# EAGLE design a78-flashcart (EAGLE 7.7.0)
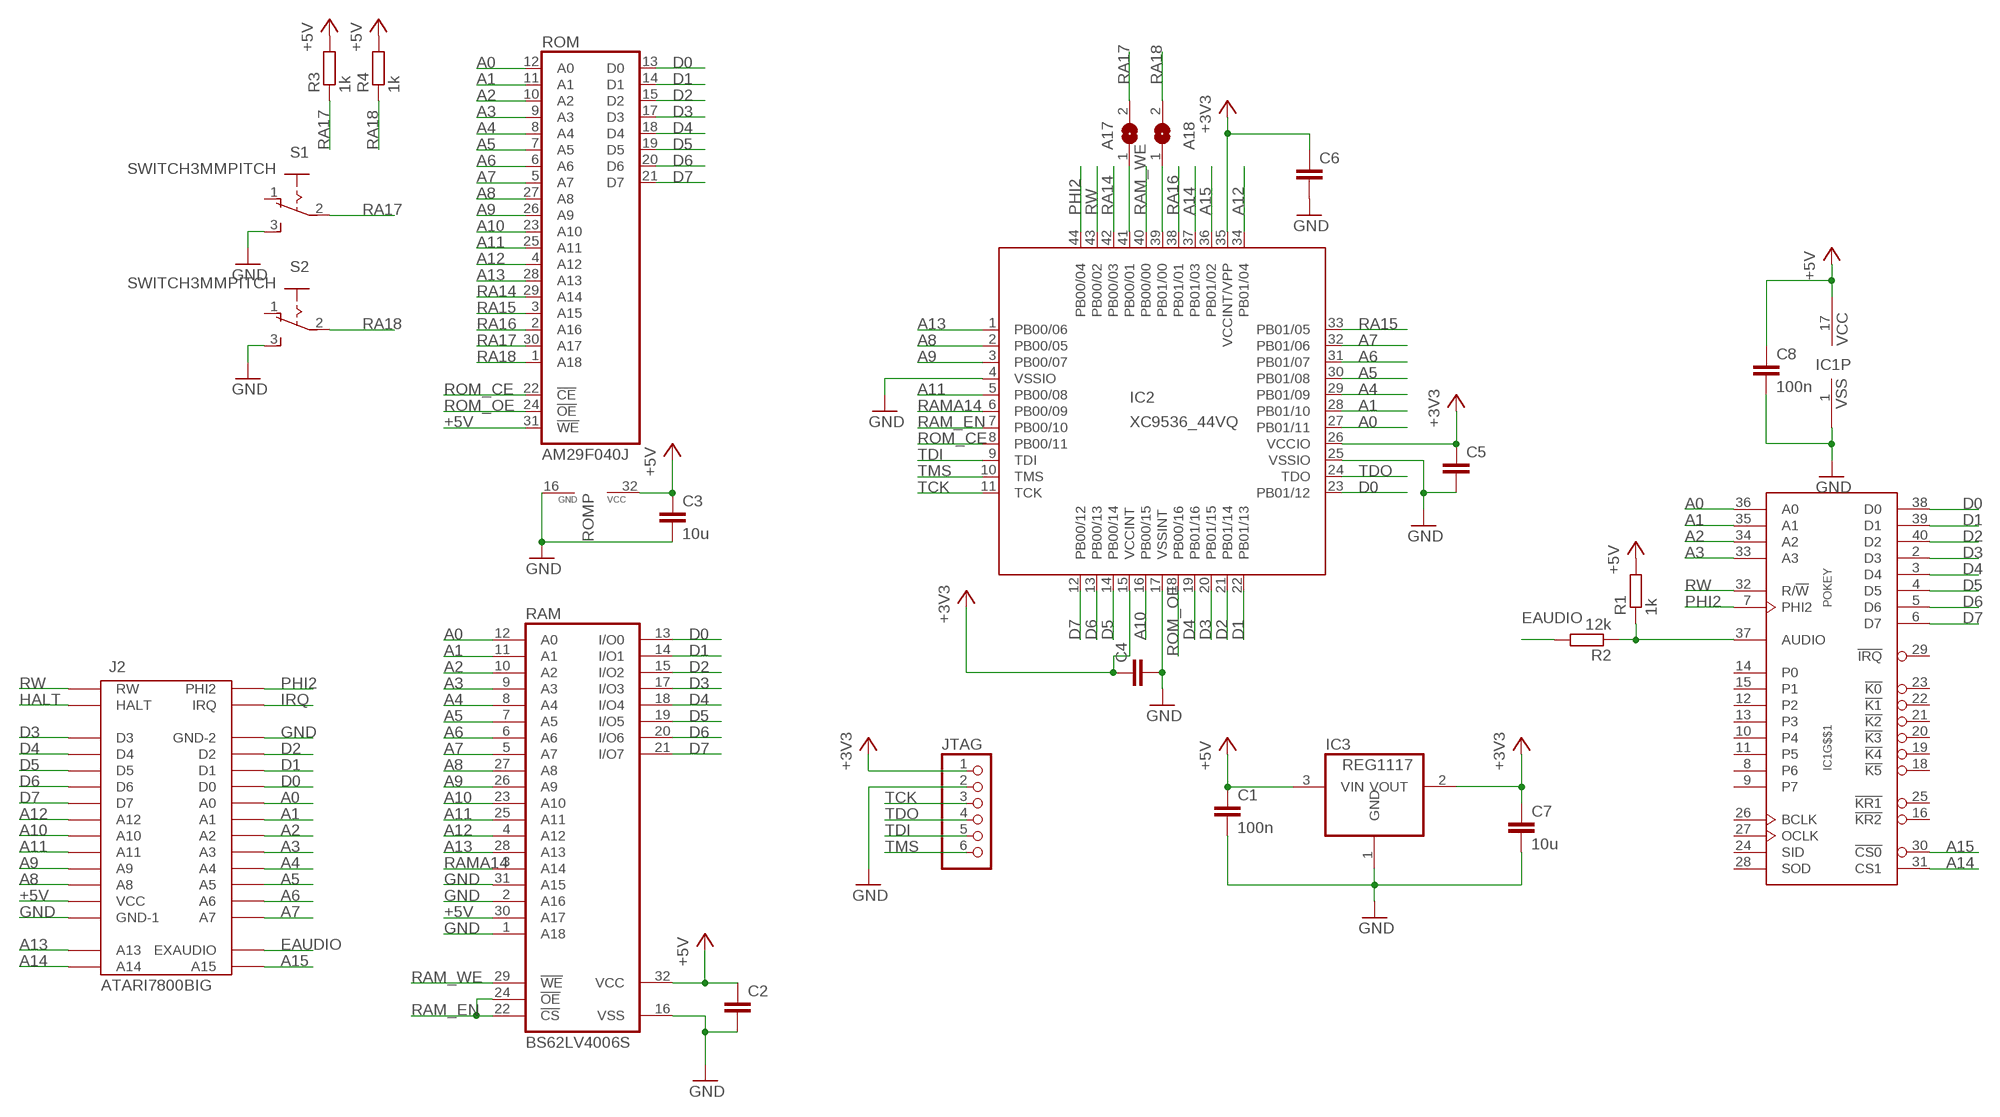
[diagram p0: schematic, sheet 1]

## Parts
A17  SJ  [SJ]
A18  SJ  [SJ]
C1  100n  C-EUC0805  [C0805]
C2  C-EUC0805  [C0805]
C3  10u  C-EUC0805  [C0805]
C4  C-EUC0805  [C0805]
C5  C-EUC0805  [C0805]
C6  C-EUC0805  [C0805]
C7  10u  C-EUC0805  [C0805]
C8  100n  C-EUC0805  [C0805]
IC1  POKEY  [DIL40]
IC2  XC9536_44VQ  [SQFP-S-10X10-44]
IC3  REG1117  [SOT223]
J2  ATARI7800BIG  [ATARI-7800-BIG]
JTAG  PINHD-1X6  [1X06]
R1  1k  R-EU_R0805  [R0805]
R2  12k  R-EU_R0805  [R0805]
R3  1k  R-EU_R0805  [R0805]
R4  1k  R-EU_R0805  [R0805]
RAM  BS62LV4006S  [SOP-32]
ROM  AM29F040J  [PLCC32R]
S1  SWITCH3MMPITCH  [SWITCH3MMPITCH]
S2  SWITCH3MMPITCH  [SWITCH3MMPITCH]

## Nets
+3V3: C4.1 C5.1 C6.1 C7.1 IC2.15(VCCINT) IC2.26(VCCIO) IC2.35(VCCINT/VPP) IC3.2(VOUT) JTAG.1
+5V: C1.1 C2.1 C3.1 C8.1 IC1.17(P:VCC) IC3.3(VIN) J2.13(VCC) R1.2 R3.2 R4.2 RAM.30(A17) RAM.32(VCC) ROM.31(!WE) ROM.32(VCC)
A0: IC1.36(G$$1:A0) IC2.27(PB01/11) J2.26(A0) RAM.12(A0) ROM.12(A0)
A1: IC1.35(G$$1:A1) IC2.28(PB01/10) J2.25(A1) RAM.11(A1) ROM.11(A1)
A2: IC1.34(G$$1:A2) J2.24(A2) RAM.10(A2) ROM.10(A2)
A3: IC1.33(G$$1:A3) J2.23(A3) RAM.9(A3) ROM.9(A3)
A4: IC2.29(PB01/09) J2.22(A4) RAM.8(A4) ROM.8(A4)
A5: IC2.30(PB01/08) J2.21(A5) RAM.7(A5) ROM.7(A5)
A6: IC2.31(PB01/07) J2.20(A6) RAM.6(A6) ROM.6(A6)
A7: IC2.32(PB01/06) J2.19(A7) RAM.5(A7) ROM.5(A7)
A8: IC2.2(PB00/05) J2.12(A8) RAM.27(A8) ROM.27(A8)
A9: IC2.3(PB00/07) J2.11(A9) RAM.26(A9) ROM.26(A9)
A10: IC2.16(PB00/15) J2.9(A10) RAM.23(A10) ROM.23(A10)
A11: IC2.5(PB00/08) J2.10(A11) RAM.25(A11) ROM.25(A11)
A12: IC2.34(PB01/04) J2.8(A12) RAM.4(A12) ROM.4(A12)
A13: IC2.1(PB00/06) J2.15(A13) RAM.28(A13) ROM.28(A13)
A14: IC1.31(G$$1:CS1) IC2.37(PB01/03) J2.16(A14)
A15: IC1.30(G$$1:!CS0) IC2.36(PB01/02) J2.17(A15)
D0: IC1.38(G$$1:D0) IC2.23(PB01/12) J2.27(D0) RAM.13(I/O0) ROM.13(D0)
D1: IC1.39(G$$1:D1) IC2.22(PB01/13) J2.28(D1) RAM.14(I/O1) ROM.14(D1)
D2: IC1.40(G$$1:D2) IC2.21(PB01/14) J2.29(D2) RAM.15(I/O2) ROM.15(D2)
D3: IC1.2(G$$1:D3) IC2.20(PB01/15) J2.3(D3) RAM.17(I/O3) ROM.17(D3)
D4: IC1.3(G$$1:D4) IC2.19(PB01/16) J2.4(D4) RAM.18(I/O4) ROM.18(D4)
D5: IC1.4(G$$1:D5) IC2.14(PB00/14) J2.5(D5) RAM.19(I/O5) ROM.19(D5)
D6: IC1.5(G$$1:D6) IC2.13(PB00/13) J2.6(D6) RAM.20(I/O6) ROM.20(D6)
D7: IC1.6(G$$1:D7) IC2.12(PB00/12) J2.7(D7) RAM.21(I/O7) ROM.21(D7)
EAUDIO: J2.18(EXAUDIO) R2.2
GND: C1.2 C2.2 C3.2 C4.2 C5.2 C6.2 C7.2 C8.2 IC1.1(P:VSS) IC2.4(VSSIO) IC2.17(VSSINT) IC2.25(VSSIO) IC3.1(GND) J2.14(GND-1) J2.30(GND-2) JTAG.2 RAM.1(A18) RAM.2(A16) RAM.16(VSS) RAM.31(A15) ROM.16(GND) S1.3(S) S2.3(S)
HALT: J2.2(HALT)
IRQ: J2.31(IRQ)
N$1: IC1.37(G$$1:AUDIO) R1.1 R2.1
N$2: A17.1 IC2.41(PB00/01)
N$3: A18.1 IC2.39(PB01/00)
PHI2: IC1.7(G$$1:PHI2) IC2.44(PB00/04) J2.32(PHI2)
RA14: IC2.42(PB00/03) ROM.29(A14)
RA15: IC2.33(PB01/05) ROM.3(A15)
RA16: IC2.38(PB01/01) ROM.2(A16)
RA17: A17.2 R3.1 ROM.30(A17) S1.2(P)
RA18: A18.2 R4.1 ROM.1(A18) S2.2(P)
RAM_EN: IC2.7(PB00/10) RAM.22(!CS) RAM.24(!OE)
RAM_WE: IC2.40(PB00/00) RAM.29(!WE)
RAMA14: IC2.6(PB00/09) RAM.3(A14)
ROM_CE: IC2.8(PB00/11) ROM.22(!CE)
ROM_OE: IC2.18(PB00/16) ROM.24(!OE)
RW: IC1.32(G$$1:R/!W) IC2.43(PB00/02) J2.1(RW)
TCK: IC2.11(TCK) JTAG.3
TDI: IC2.9(TDI) JTAG.5
TDO: IC2.24(TDO) JTAG.4
TMS: IC2.10(TMS) JTAG.6
Unconnected: IC1.8(G$$1:P6) IC1.9(G$$1:P7) IC1.10(G$$1:P4) IC1.11(G$$1:P5) IC1.12(G$$1:P2) IC1.13(G$$1:P3) IC1.14(G$$1:P0) IC1.15(G$$1:P1) IC1.16(G$$1:!KR2) IC1.18(G$$1:!K5) IC1.19(G$$1:!K4) IC1.20(G$$1:!K3) IC1.21(G$$1:!K2) IC1.22(G$$1:!K1) IC1.23(G$$1:!K0) IC1.24(G$$1:SID) IC1.25(G$$1:!KR1) IC1.26(G$$1:BCLK) IC1.27(G$$1:OCLK) IC1.28(G$$1:SOD) IC1.29(G$$1:!IRQ) S1.1(O) S2.1(O)

## Library data of the parts
A17 A18 = jumper:SJ: SMD solder JUMPER
C1-C8 = rcl:C-EU: CAPACITOR, European symbol
IC1 = eagle-6.5.0-atari:POKEY: POKEY
IC2 = xilinx-xc9:XC9536_44VQ: xc9536_pc44 XC9500 In-System Programmable CPLD Family Auto generated by make-symbol-device-package-bsdl.ulp Rev. 34 Source: xc9536_vq44.bsd; MPN: XC9536-15VQG44C; OC_FARNELL: 1193227; OC_NEWARK: 98K3377
IC3 = burr-brown:REG1117: 800mA and 1A Low Dropout (LDO) Positive Regulator 1.8V, 2.5V, 2.85V, 3.3V, 5V, and Adj; MPN: REG1117; OC_FARNELL: 1097566; OC_NEWARK: 14P6981
J2 = eagle-6.5.0-atari:ATARI7800BIG
JTAG = adafruit:PINHD-1X6: PIN HEADER
R1-R4 = rcl:R-EU_: RESISTOR, European symbol
RAM = memory-bsi:BS62LV4006
ROM = am29-memory:AM29F040J: 4-Megabit FLASH MEMORY (512 K x 8 bit) 5 V-only
S1 S2 = eagle-6.5.0-atari:SWITCH3MMPITCH: 3mm pitch slide switch

## Board
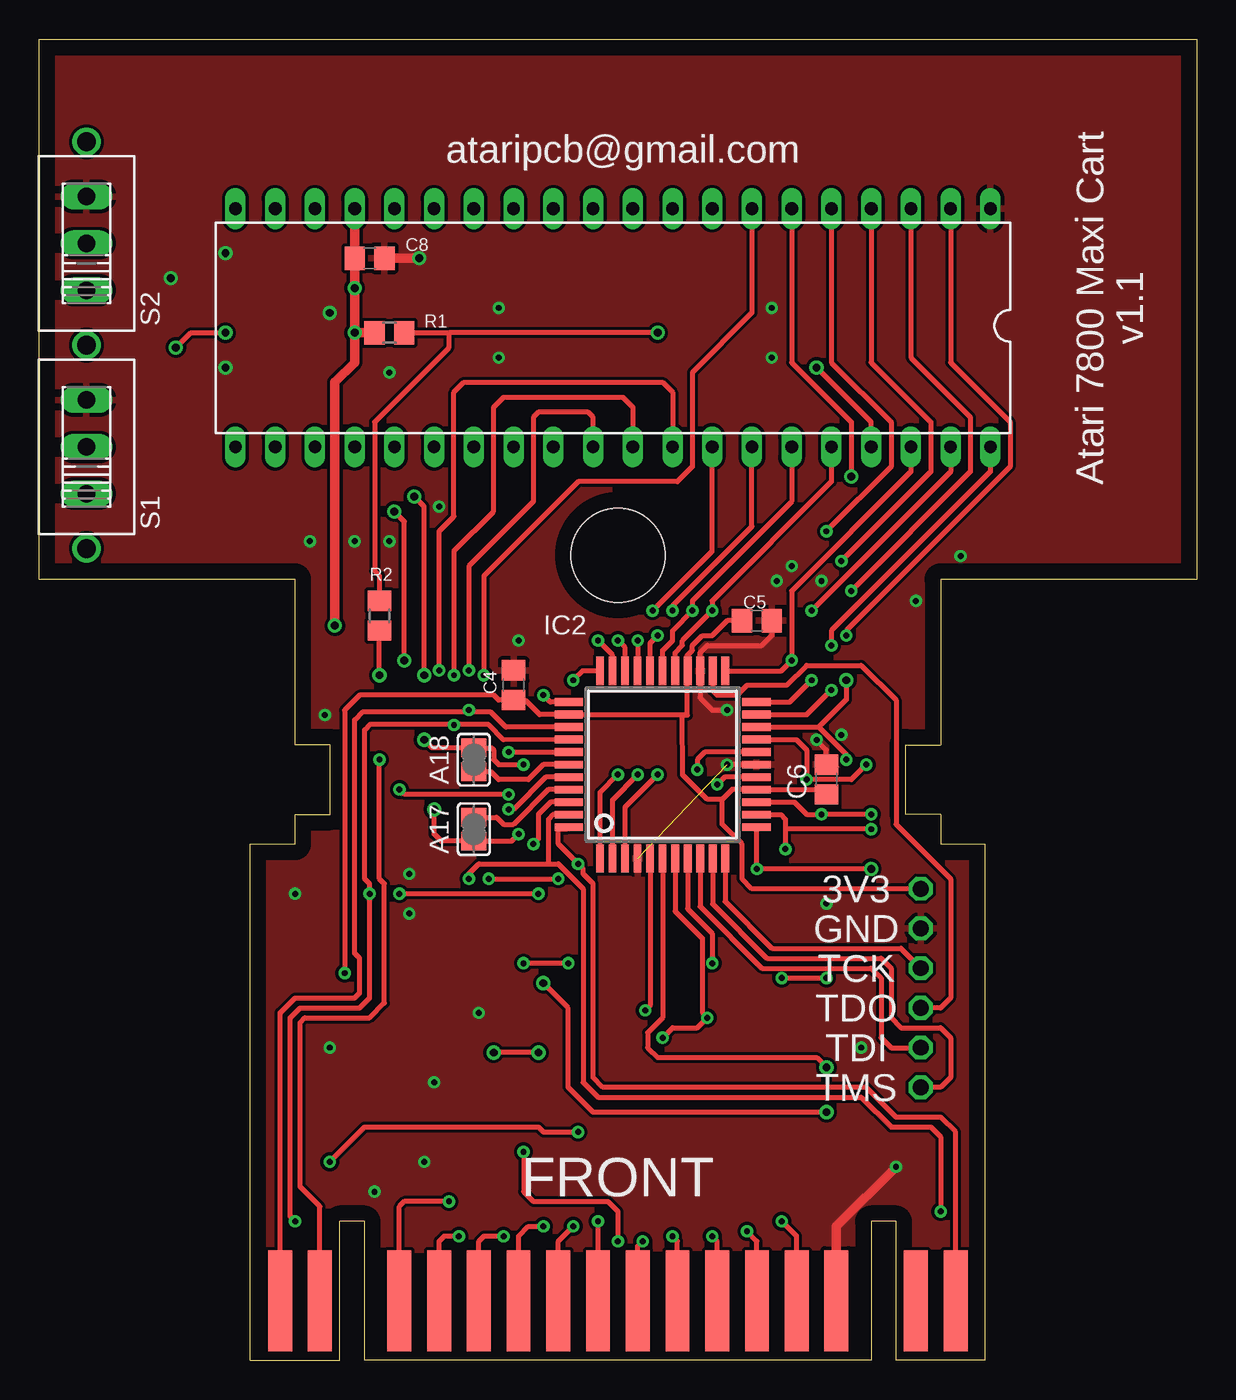
[diagram p1: board, top side]
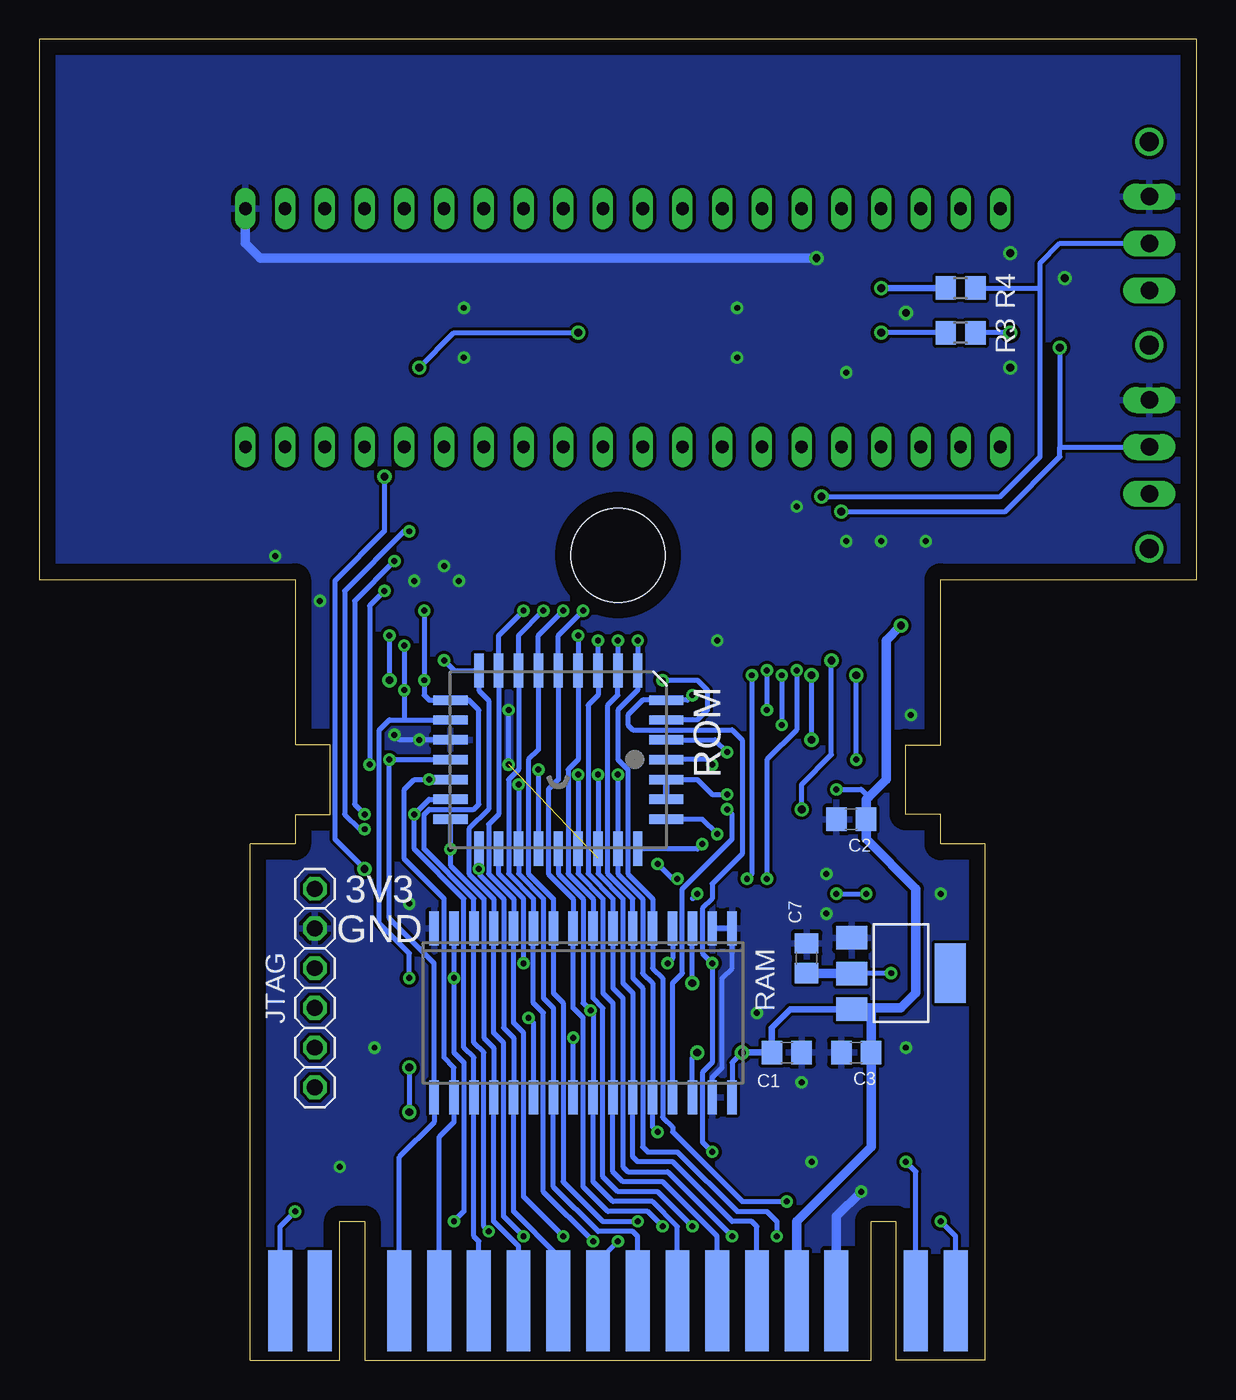
[diagram p2: board, bottom side, seen from below]

Size 74 x 84.5 mm. Coordinates in mm from the lower left corner, seen from the top.
Copper layers (1*16): Top 0.035mm / dielectric 1.5mm / Bottom 0.035mm
Design rules "default": minimum track width 10mil, minimum drill 24mil, track to track 8mil, track to pad 8mil, pad to pad 8mil, via to via 8mil, smd to smd 8mil, copper to edge 40mil, drill to drill 8mil, minimum pad ring 10mil, minimum via ring 8mil, stop-mask expansion 4mil, vias tented up to drill 0mil, thermal gap 10mil

### Footprints (pad centres in the part's own frame; a part is rotated, then mirrored left to right if it is on the bottom)
SJ = smd 1.168 x 1.6: 1 -0.762,0; 2 0.762,0
C0805 = smd 1.3 x 1.5: 1 -0.95,0; 2 0.95,0
DIL40 = drill 0.813 long: 1 -24.13,-7.62; 2 -21.59,-7.62; 3 -19.05,-7.62; 4 -16.51,-7.62; 5 -13.97,-7.62; 6 -11.43,-7.62; 7 -8.89,-7.62; 8 -6.35,-7.62; 9 -3.81,-7.62; 10 -1.27,-7.62; 11 1.27,-7.62; 12 3.81,-7.62; 13 6.35,-7.62; 14 8.89,-7.62; 15 11.43,-7.62; 16 13.97,-7.62; 17 16.51,-7.62; 18 19.05,-7.62; 19 21.59,-7.62; 20 24.13,-7.62; 21 24.13,7.62; 22 21.59,7.62; 23 19.05,7.62; 24 16.51,7.62; 25 13.97,7.62; 26 11.43,7.62; 27 8.89,7.62; 28 6.35,7.62; 29 3.81,7.62; 30 1.27,7.62; 31 -1.27,7.62; 32 -3.81,7.62; 33 -6.35,7.62; 34 -8.89,7.62; 35 -11.43,7.62; 36 -13.97,7.62; 37 -16.51,7.62; 38 -19.05,7.62; 39 -21.59,7.62; 40 -24.13,7.62
SQFP-S-10X10-44 = smd 0.5 x 1.8: 1 -4,-6; 2 -3.2,-6; 3 -2.4,-6; 4 -1.6,-6; 5 -0.8,-6; 6 0,-6; 7 0.8,-6; 8 1.6,-6; 9 2.4,-6; 10 3.2,-6; 11 4,-6; 23 4,6; 24 3.2,6; 25 2.4,6; 26 1.6,6; 27 0.8,6; 28 0,6; 29 -0.8,6; 30 -1.6,6; 31 -2.4,6; 32 -3.2,6; 33 -4,6 | smd 1.8 x 0.5: 12 6,-4; 13 6,-3.2; 14 6,-2.4; 15 6,-1.6; 16 6,-0.8; 17 6,0; 18 6,0.8; 19 6,1.6; 20 6,2.4; 21 6,3.2; 22 6,4; 34 -6,4; 35 -6,3.2; 36 -6,2.4; 37 -6,1.6; 38 -6,0.8; 39 -6,0; 40 -6,-0.8; 41 -6,-1.6; 42 -6,-2.4; 43 -6,-3.2; 44 -6,-4
SOT223 = smd 1.499 x 2.007: 1 -2.261,-3.15; 2 0.025,-3.15; 3 2.311,-3.15 | smd 3.81 x 2.007: 4 0,3.15
ATARI-7800-BIG = smd 1.524 x 6.477: 1 -21.59,3.81; 2 -19.05,3.81; 3 -13.97,3.81; 4 -11.43,3.81; 5 -8.89,3.81; 6 -6.35,3.81; 7 -3.81,3.81; 8 -1.27,3.81; 9 1.27,3.81; 10 3.81,3.81; 11 6.35,3.81; 12 8.89,3.81; 13 11.43,3.81; 14 13.97,3.81; 15 19.05,3.81; 16 21.59,3.81 | smd 1.524 x 6.477 bottom: 17 21.59,3.81; 18 19.05,3.81; 19 13.97,3.81; 20 11.43,3.81; 21 8.89,3.81; 22 6.35,3.81; 23 3.81,3.81; 24 1.27,3.81; 25 -1.27,3.81; 26 -3.81,3.81; 27 -6.35,3.81; 28 -8.89,3.81; 29 -11.43,3.81; 30 -13.97,3.81; 31 -19.05,3.81; 32 -21.59,3.81 | hole 6: 0,51.5
1X06 = drill 1.016 octagon: 1 -6.35,0; 2 -3.81,0; 3 -1.27,0; 4 1.27,0; 5 3.81,0; 6 6.35,0
R0805 = smd 1.3 x 1.5: 1 -0.95,0; 2 0.95,0
SOP-32 = smd 0.6 x 2.2: 1 -9.525,-5.4; 2 -8.255,-5.4; 3 -6.985,-5.4; 4 -5.715,-5.4; 5 -4.445,-5.4; 6 -3.175,-5.4; 7 -1.905,-5.4; 8 -0.635,-5.4; 9 0.635,-5.4; 10 1.905,-5.4; 11 3.175,-5.4; 12 4.445,-5.4; 13 5.715,-5.4; 14 6.985,-5.4; 15 8.255,-5.4; 16 9.525,-5.4; 17 9.525,5.4; 18 8.255,5.4; 19 6.985,5.4; 20 5.715,5.4; 21 4.445,5.4; 22 3.175,5.4; 23 1.905,5.4; 24 0.635,5.4; 25 -0.635,5.4; 26 -1.905,5.4; 27 -3.175,5.4; 28 -4.445,5.4; 29 -5.715,5.4; 30 -6.985,5.4; 31 -8.255,5.4; 32 -9.525,5.4
PLCC32R = smd 0.6 x 2.2: 1 0,6.9; 2 -1.27,6.9; 3 -2.54,6.9; 4 -3.81,6.9; 14 -3.81,-6.9; 15 -2.54,-6.9; 16 -1.27,-6.9; 17 0,-6.9; 18 1.27,-6.9; 19 2.54,-6.9; 20 3.81,-6.9; 30 3.81,6.9; 31 2.54,6.9; 32 1.27,6.9 | smd 2.2 x 0.6: 5 -5.7,5.08; 6 -5.7,3.81; 7 -5.7,2.54; 8 -5.7,1.27; 9 -5.7,0; 10 -5.7,-1.27; 11 -5.7,-2.54; 12 -5.7,-3.81; 13 -5.7,-5.08; 21 5.7,-5.08; 22 5.7,-3.81; 23 5.7,-2.54; 24 5.7,-1.27; 25 5.7,0; 26 5.7,1.27; 27 5.7,2.54; 28 5.7,3.81; 29 5.7,5.08
SWITCH3MMPITCH = drill 1.118 long: 1 -3,0; 2 0,0; 3 3,0 | drill 1.2: P$1 -6.5,0; P$2 6.5,0

### Placement (x,y rotation side)
A17  27.79,33.97 270 top
A18  27.79,38.42 90 top
C1  26.2,19.68 0 bottom
C2  22.08,34.61 180 bottom
C3  21.76,19.68 180 bottom
C4  30.33,43.18 90 top
C5  45.89,47.31 0 top
C6  50.34,37.15 90 top
C7  24.94,25.72 90 bottom
C8  21.12,70.48 0 top
IC1  36.68,66.04 180 top
IC2  39.86,38.1 0 top
IC3  18.9,24.77 270 bottom
J2  37,0 0 bottom
JTAG  56.37,23.81 270 bottom
R1  22.39,65.72 180 top
R2  21.76,47.62 270 top
R3  15.09,65.72 180 bottom
R4  15.09,68.58 180 bottom
RAM  39.22,22.22 180 bottom
ROM  40.81,38.42 270 bottom
S1  3.03,58.42 90 top
S2  3.03,71.44 90 top

### Tracks (layer width: path | path; a pad name or v marks a point on that pad's centre or on a via)
+3V3  (via drill 0.38)
  Top 0.305: C6.1 50.22,36.5 IC2.15 45.84,36.51 44.3,36.51 43.67,35.88 | 41.45,41.27 41.42,41.3 IC2.35 32,41.3 31.07,42.23 C4.1 29.38,42.23 29.06,42.55 20.49,42.55 19.54,41.59 v19.54,24.77 | 41.45,41.27 41.45,44.09 IC2.26 41.43,44.86 41.43,45.07 41.76,45.4 41.76,45.72 42.4,46.35 43.03,46.35 43.98,47.31 C5.1 | 43.67,35.88 42.71,35.88 41.14,37.45 41.13,41.27 41.45,41.27 | JTAG.1 45.57,30.16 44.94,30.8 44.94,33.02 43.67,34.29 43.67,35.88
  Bottom 0.305: v19.54,24.77 22.03,24.77 IC3.2
  Bottom 0.61: 22.07,24.72 IC3.2 24.91,24.74 C7.1
+5V  (via drill 0.38, 0.5, 0.5 pad 0.3)
  Top 0.305: v30.02,36.2 23.35,36.2 v23.03,36.51 | v31.92,19.68 v29.06,19.68
  Top 0.61: v18.9,46.99 18.9,62.55 20.17,63.82 v20.17,65.72 | IC1.17 20.17,70.27 C8.1 20.17,70.06 v20.17,68.58 v20.17,65.72 | R1.2 v20.17,65.72
  Bottom 0.305: v29.06,19.68 29.7,19.05 RAM.32 29.59,16.72 | ROM.32 31.92,37.15 30.97,36.2 v30.02,36.2 | RAM.30 32.24,19.37 v31.92,19.68 | v23.03,36.51 21.44,36.51 20.97,36.04 | R3.2 v20.17,65.72
  Bottom 0.406: ROM.31 ROM.32 | IC3.3 25.98,22.45 27.16,21.27 C1.1 v29.06,19.68 | R4.2 v20.17,68.58
  Bottom 0.61: C3.1 20.81,13.65 25.57,8.89 J2.13 | C3.1 20.81,22.22 21.13,22.54 | 21.13,22.54 21.96,22.54 IC3.3 | C3.1 | 21.13,22.54 18.9,22.54 17.95,23.5 17.95,30.16 21.13,33.34 C2.1 21.13,35.88 20.97,36.04 19.86,37.15 19.86,46.04 v18.9,46.99
A0  (via drill 0.38)
  Top 0.305: IC2.27 40.66,45.25 41.13,45.72 41.13,46.04 v43.03,47.94 43.03,48.58 50.65,56.2 IC1.36 | J2.26 40.81,7.62 v40.49,7.94
  Bottom 0.305: v40.49,7.94 43.03,10.48 43.03,20.95 43.67,21.59 RAM.12 43.67,29.53 45.26,31.12 45.26,34.29 44.62,34.92 ROM.12 44.62,46.35 v43.03,47.94
A1  (via drill 0.38)
  Top 0.305: IC2.28 39.86,45.4 40.49,46.04 40.49,46.67 v41.76,47.94 41.76,48.58 48.11,54.93 IC1.35 | J2.25 38.27,7.3 v38.59,7.62
  Bottom 0.305: v38.59,7.62 41.76,10.8 41.76,22.22 42.4,22.86 RAM.11 42.4,29.53 43.98,31.12 43.98,37.15 43.35,37.78 ROM.11 43.35,46.35 v41.76,47.94
A2  (via drill 0.38)
  Top 0.305: IC1.34 45.57,53.34 40.49,48.26 v40.49,47.94 | J2.24 v35.73,8.89
  Bottom 0.305: v35.73,8.89 37.95,8.89 40.49,11.43 40.49,22.86 41.13,23.5 RAM.10 41.13,29.53 42.71,31.12 42.71,38.42 42.08,39.05 ROM.10 42.08,46.35 v40.49,47.94
A3  (via drill 0.38)
  Top 0.305: v34.14,8.57 33.19,7.62 J2.23 | IC1.33 43.03,51.75 v39.22,47.94
  Bottom 0.305: v34.14,8.57 35.09,9.52 37.64,9.52 39.22,11.11 39.22,21.91 39.86,22.54 RAM.9 39.86,29.53 41.45,31.12 41.45,36.51 40.81,37.15 ROM.9 40.81,46.35 v39.22,47.94
A4  (via drill 0.38)
  Top 0.305: v32.24,8.57 31.29,8.57 30.65,7.94 J2.22 | IC2.29 39.06,45.87 v39.54,46.35
  Bottom 0.305: v32.24,8.57 34.46,10.8 37,10.8 37.95,11.75 37.95,22.54 38.59,23.18 RAM.8 38.59,29.53 40.18,31.12 40.18,37.78 39.54,38.42 ROM.8 v39.54,46.35
A5  (via drill 0.38)
  Top 0.305: v29.7,7.94 28.43,7.94 28.11,7.62 J2.21 | v38.27,46.04 ROM.7 IC2.30
  Bottom 0.305: v29.7,7.94 33.82,12.07 36.36,12.07 36.68,12.38 36.68,23.18 37.32,23.81 RAM.7 37.32,29.53 38.91,31.12 38.91,41.91 38.27,42.55 ROM.7 v38.27,46.04
A6  (via drill 0.38)
  Top 0.305: v26.84,7.94 25.89,7.94 25.57,7.62 J2.20 | IC2.31 37.46,45.58 v37,46.04
  Bottom 0.305: v26.84,7.94 26.84,8.89 27.47,9.52 29.38,9.52 33.19,13.33 35.09,13.33 35.41,13.65 35.41,23.81 36.05,24.45 RAM.6 36.05,29.53 37.64,31.12 37.64,41.91 37,42.55 ROM.6 v37,46.04
A7  (via drill 0.38)
  Top 0.305: v26.21,10.16 23.35,10.16 23.03,9.84 J2.19 | IC2.32 36.66,45.11 v35.73,46.04
  Bottom 0.305: v26.21,10.16 29.06,10.16 33.51,14.6 33.51,14.92 34.14,15.56 34.14,24.45 34.78,25.08 RAM.5 34.78,29.53 36.36,31.12 36.36,37.78 37,38.42 37,41.59 35.73,42.86 ROM.5 v35.73,46.04
A8  (via drill 0.38)
  Top 0.305: IC2.2 36.66,35.85 v38.27,37.46
  Bottom 0.305: v38.27,37.46 ROM.27 38.27,31.12 36.68,29.53 36.68,24.13 36.05,23.5 RAM.27 36.05,13.02 35.73,12.7 33.51,12.7 29.7,8.89 28.43,8.89 28.11,8.57 J2.12
A9  (via drill 0.38)
  Top 0.305: IC2.3 37.46,35.38 v39.54,37.46
  Bottom 0.305: v39.54,37.46 ROM.26 39.54,31.12 37.95,29.53 37.95,23.5 37.32,22.86 RAM.26 37.32,12.07 36.68,11.43 34.14,11.43 30.65,7.94 J2.11
A10  (via drill 0.38)
  Top 0.305: IC2.16 43.82,37.3 v43.35,36.83
  Bottom 0.305: v43.35,36.83 ROM.23 43.35,31.12 41.76,29.53 41.76,23.18 41.13,22.54 RAM.23 41.13,11.11 38.27,8.25 36.05,8.25 35.73,7.94 J2.9
A11  (via drill 0.38)
  Top 0.305: IC2.5 39.06,22.7 v38.75,22.38
  Bottom 0.305: ROM.25 40.81,31.12 39.22,29.53 39.22,22.86 v38.75,22.38 38.59,22.22 RAM.25 38.59,11.43 37.32,10.16 34.78,10.16 33.19,8.57 J2.10
A12  (via drill 0.38)
  Top 0.305: v30.97,13.33 30.97,10.8 31.6,10.16 36.36,10.16 37,9.52 v37,7.62 | v33.82,25.4 v30.97,25.4 | IC2.34 32.68,42.1 v32.24,42.55
  Bottom 0.305: v30.97,13.33 31.6,13.97 31.6,18.41 30.97,19.05 v30.97,25.4 31.6,26.04 31.6,28.89 30.97,29.53 30.97,30.48 29.06,32.38 29.06,39.69 29.7,40.32 36.05,40.32 36.36,40.64 36.36,41.27 35.41,42.23 ROM.4 32.55,42.23 v32.24,42.55 | v37,7.62 38.27,6.35 J2.8 | RAM.4 33.51,25.72 v33.82,25.4
A13  (via drill 0.38)
  Top 0.305: v18.58,12.7 20.81,14.92 31.92,14.92 32.24,14.6 v34.46,14.6 | IC2.1 35.86,36.32 v37,37.46
  Bottom 0.305: v34.46,14.6 34.78,14.92 RAM.28 34.78,24.13 35.41,24.77 35.41,29.53 37,31.12 ROM.28 v37,37.46 | J2.15 17.95,12.07 v18.58,12.7
A14  (via drill 0.38, 0.38 pad 0.3)
  Top 0.305: v16.36,8.89 16.04,9.21 16.04,21.91 16.68,22.54 20.49,22.54 21.13,23.18 v21.13,29.84 21.13,30.48 20.81,30.8 20.81,40.32 21.14,40.65 26.52,40.65 | IC2.37 29.7,39.69 28.73,40.65 26.52,40.65 | v31.92,29.84 v23.03,29.84 | v26.52,43.81 26.52,51.75 29.06,54.29 29.06,60.96 29.7,61.59 37.32,61.59 37.95,60.96 IC1.31 | v26.52,40.64 26.52,40.65
  Bottom 0.305: v16.36,8.89 15.41,7.94 J2.16 | 32.24,29.53 v31.92,29.84 | v23.03,29.84 v21.13,29.84 | v26.52,43.81 v26.52,40.64
A15  (via drill 0.38)
  Top 0.305: 27.47,41.45 28.88,41.45 29.84,40.5 IC2.36 | 27.47,41.45 20.67,41.45 20.17,40.96 20.17,26.04 20.49,25.72 20.49,23.5 20.17,23.18 16.36,23.18 15.41,22.22 J2.17 | v27.47,44.13 27.47,50.8 31.6,54.93 31.6,60.33 31.92,60.64 35.09,60.64 35.41,60.33 IC1.30 | v27.47,41.59 27.47,41.45
  Bottom 0.305: v27.47,44.13 v27.47,41.59
D0  (via drill 0.38)
  Top 0.305: IC2.23 47.45,44.1 v48.11,44.77 48.11,49.21 55.73,56.83 IC1.38 | J2.27 43.35,7.62 v43.03,7.94
  Bottom 0.305: v43.03,7.94 44.3,9.21 44.3,20.32 44.94,20.95 RAM.13 44.94,29.53 46.52,31.12 46.52,33.97 45.26,35.24 45.26,42.21 45.89,42.85 ROM.13 47.46,44.12 v48.11,44.77
D1  (via drill 0.38)
  Top 0.305: v45.26,8.25 45.89,7.62 J2.28 | IC2.22 47.98,42.1 v49.38,43.5 | IC1.39 58.27,56.83 v49.38,47.94
  Bottom 0.305: v45.26,8.25 45.57,8.57 45.57,19.68 46.21,20.32 RAM.14 46.21,29.53 49.38,32.7 49.38,34.92 49.06,35.24 46.21,35.24 45.89,35.56 45.89,41.59 46.52,42.23 ROM.14 49.06,42.23 49.38,42.55 v49.38,43.5 v49.38,47.94
D2  (via drill 0.38)
  Top 0.305: v47.48,8.89 48.43,7.94 J2.29 | IC2.21 49.09,41.3 v50.65,42.86 | v47.48,24.45 v50.34,24.45 | IC1.40 60.81,56.83 50.65,46.67 v50.65,45.72
  Bottom 0.305: v47.48,8.89 46.84,9.52 46.84,19.05 47.48,19.68 v47.48,24.45 RAM.15 | 50.65,40.96 v50.65,42.86 v50.65,45.72 | v50.34,24.45 50.34,26.04 52.24,27.94 52.24,40.32 51.6,40.96 50.65,40.96 | 50.65,40.96 ROM.15
D3  (via drill 0.38, 0.5)
  Top 0.305: IC2.20 49.84,40.5 | 49.84,40.5 51.6,38.74 v51.6,38.42 | IC1.2 58.27,63.82 62.08,60.01 62.08,57.15 51.6,46.67 v51.6,46.35 | v51.6,43.5 51.6,42.27 49.84,40.5
  Bottom 0.305: ROM.17 v51.6,38.42 51.6,28.25 48.75,25.4 48.75,22.22 RAM.17 48.75,15.24 50.97,13.02 J2.3 | v51.6,46.35 v51.6,43.5
D4  (via drill 0.38)
  Top 0.305: IC2.19 48.42,39.7 49.06,39.05 v49.06,37.15 51.92,37.15 v52.88,38.1 | IC1.3 55.73,64.14 59.54,60.33 59.54,56.83 v51.92,49.21
  Bottom 0.305: ROM.18 v49.06,37.15 50.02,37.15 50.65,36.51 50.65,32.07 48.11,29.53 48.11,19.37 47.48,18.73 RAM.18 47.48,15.24 48.43,14.29 J2.4 | v51.92,49.21 52.88,48.26 v52.88,38.1
D5  (via drill 0.38)
  Top 0.305: IC2.14 48.29,35.7 49.06,34.92 v50.02,34.92 v53.19,34.92 | IC1.4 53.19,63.82 57,60.01 57,56.83 v51.29,51.12
  Bottom 0.305: ROM.19 49.06,35.88 v50.02,34.92 50.02,32.7 46.84,29.53 46.84,20 46.21,19.37 RAM.19 46.21,7.94 45.89,7.62 J2.5 | v51.29,51.12 53.83,48.58 53.83,35.56 v53.19,34.92
D6  (via drill 0.38)
  Top 0.305: IC2.13 47.42,34.9 ROM.20 47.71,33.97 | 47.71,33.97 v47.71,32.7 | IC1.5 50.65,63.82 54.46,60.01 54.46,57.15 v50.34,53.02 | v53.19,33.97 47.71,33.97
  Bottom 0.305: ROM.20 v47.71,32.7 47.71,31.66 45.57,29.53 45.57,20.64 44.94,20 RAM.20 44.94,8.89 43.35,7.3 J2.6 | v50.34,53.02 50.65,53.02 54.46,49.21 54.46,34.92 53.51,33.97 v53.19,33.97
D7  (via drill 0.38, 0.5)
  Top 0.305: IC2.12 45.86,31.46 v45.89,31.43 v53.19,31.43 | IC1.6 48.11,63.82 51.92,60.01 v51.92,56.52
  Bottom 0.305: ROM.21 v45.89,31.43 45.89,31.12 44.3,29.53 44.3,21.27 43.67,20.64 RAM.21 43.67,9.52 40.81,6.67 J2.7 | v51.92,56.52 51.92,53.02 55.1,49.85 55.1,33.34 v53.19,31.43
EAUDIO  (via drill 0.38 pad 0.3, 0.5 pad 0.3)
  Top 0.305: v21.76,38.42 21.76,30.8 22.08,30.48 22.08,22.86 21.13,21.91 17,21.91 16.68,21.59 16.68,11.11 17.95,9.84 J2.18 | v21.76,43.81 R2.2
  Bottom 0.305: v21.76,38.42 v21.76,43.81
GND  (via drill 0.38, 0.5 pad 0.3)  (1 unrouted)
  Top 0.305: C6.2 50.34,39.05 v49.7,39.69 | v43.98,41.59 43.03,41.59 42.26,42.37 IC2.25 42.26,45.26 42.71,45.72 46.21,45.72 46.84,46.35 C5.2 | IC2.17 v43.98,38.1
  Top 0.61: C8.2 v24.3,70.49 | J2.30 50.97,8.57 v54.78,12.38
  Bottom 0.305: RAM.2 RAM.1 29.7,25.08 30.33,24.45 30.33,18.73 30.97,18.1 RAM.31 | ROM.16 v49.7,39.69 50.97,39.69 v51.29,40.01 | v43.98,38.1 v43.98,41.59
  Bottom 0.61: v24.3,70.49 59.86,70.49 60.81,71.44 IC1.1 | J2.14 23.03,9.21 v21.44,10.8
  other vias: 50.34,29.21 30.65,46.04 25.25,17.78 23.66,28.57 56.05,48.58 50.02,49.85 18.27,41.27 24.62,12.7 18.59,20 52.56,20 47.16,49.85 23.66,31.12 25.57,54.61 28.11,22.22 16.36,29.84 58.91,51.44 29.38,67.31 29.38,64.14 22.39,52.39 20.17,52.39 17.32,52.39 46.84,67.31 46.84,64.14 48.11,50.8 8.43,69.22 11.92,70.8 18.59,66.99 11.92,63.5 22.39,63.18
  pour Top (isolate 0.16): 60.49,7.3 60.49,49.85 73.83,49.85 73.83,84.45 0.17,84.45 0.17,49.85 12.87,49.85 12.87,6.99
  pour Bottom (isolate 0.16): 60.49,7.3 60.49,49.85 73.83,49.85 73.83,84.45 0.17,84.45 0.17,49.85 12.87,49.85 12.87,6.99
N$1  (via drill 0.5 pad 0.3)
  Top 0.305: IC1.37 53.19,60.01 v49.7,63.5 | v39.54,65.72 26.21,65.72 | R2.1 21.76,50.16 21.44,50.48 21.44,60.01 26.21,64.77 26.21,65.72 | R1.1 26.21,65.72
  Bottom 0.305: v49.7,63.5 47.48,65.72 v39.54,65.72
N$2
  Top 0.305: IC2.41 32.54,36.5 30.33,34.29 29.7,34.29 29.25,34.73 A17.1
N$3
  Top 0.305: IC2.39 32.24,38.1 31.29,37.15 29.38,37.15 28.87,37.66 A18.1
PHI2  (via drill 0.38)
  Top 0.305: IC2.44 33.73,33.97 33.19,33.97 33.19,33.02 v34.46,31.75 34.78,31.43 34.78,31.12 35.41,30.48 35.41,18.1 36.05,17.46 52.88,17.46 54.78,15.56 57.64,15.56 58.59,14.6 J2.32 | IC1.7 45.57,66.99 41.76,63.18 41.76,57.15 40.81,56.2 34.46,56.2 28.43,50.16 v28.43,43.81 | v28.74,30.8 v33.19,30.8
  Bottom 0.305: v28.43,43.81 28.43,31.12 v28.74,30.8 | v33.19,30.8 33.51,30.8 v34.46,31.75
RA14  (via drill 0.38)
  Top 0.305: IC2.42 32.7,35.7 31.92,34.92 31.92,33.34 v31.6,33.02
  Bottom 0.305: v31.6,33.02 31.92,32.7 35.71,32.7 ROM.29
RA15  (via drill 0.38)
  Top 0.305: IC2.33 34.75,44.1 v34.14,43.5
  Bottom 0.305: ROM.3 31.92,40.96 31.29,41.59 31.29,42.86 31.92,43.5 v34.14,43.5
RA16  (via drill 0.38)
  Top 0.305: v30.02,38.9 IC2.38
  Bottom 0.305: ROM.2 30.8,39.69 v30.02,38.9
RA17  (via drill 0.38, 0.5)
  Top 0.305: v30.65,33.66 30.21,33.21 A17.2 25.7,33.21 25.25,33.66 v25.25,35.24 | v22.71,54.29 23.35,53.66 v23.35,44.77 | v8.74,64.77 9.69,65.72 v11.92,65.72
  Bottom 0.305: v30.65,33.66 31.6,34.61 ROM.30 | v25.25,35.24 25.25,36.83 23.35,38.74 v23.35,44.77 | v22.71,54.29 12.23,54.29 8.74,57.78 8.74,58.42 | 8.74,58.42 S1.2 | v8.74,64.77 8.74,58.42 | v11.92,65.72 R3.1
RA18  (via drill 0.38, 0.5)
  Top 0.305: v30.97,38.1 29.38,38.1 29.06,38.42 29.06,39.05 28.94,39.18 A18.2 25.13,39.18 v24.62,39.69 | v24.62,43.81 24.62,54.61 v23.98,55.24
  Bottom 0.305: v30.97,38.1 31.29,38.42 ROM.1 | v24.62,39.69 v24.62,43.81 | v23.98,55.24 12.55,55.24 10.01,57.78 10.01,68.58 | S2.2 8.74,71.44 10.01,70.17 10.01,68.58 | R4.1 10.01,68.58
RAM_EN  (via drill 0.38)
  Top 0.305: IC2.7 40.66,28.73 42.4,26.99 42.4,22.22 v42.71,21.91 42.08,21.27 40.49,21.27 v39.86,20.64
  Bottom 0.305: v42.71,21.91 42.4,21.59 RAM.22 | RAM.24 v39.86,20.64
RAM_WE  (via drill 0.38)
  Top 0.305: IC2.40 32.39,37.3 30.33,35.24 v30.02,35.24
  Bottom 0.305: RAM.29 33.51,24.13 32.87,24.77 32.87,30.16 29.7,33.34 29.7,34.92 v30.02,35.24
RAMA14  (via drill 0.5)
  Top 0.305: IC2.6 39.86,21.91 38.91,20.95 38.91,20 39.54,19.37 49.7,19.37 v50.34,18.73 | v50.34,15.88 35.41,15.88 33.82,17.46 33.82,22.54 v32.24,24.13
  Bottom 0.305: v50.34,18.73 v50.34,15.88 | v32.24,24.13 RAM.3
ROM_CE  (via drill 0.38)
  Top 0.305: IC2.8 41.46,28.88 43.03,27.31 v43.03,25.4
  Bottom 0.305: v43.03,25.4 43.03,29.53 44.62,31.12 ROM.22
ROM_OE  (via drill 0.38)
  Top 0.305: v42.08,37.78 42.08,38.42 42.56,38.9 IC2.18
  Bottom 0.305: v42.08,37.78 ROM.24
RW  (via drill 0.38)
  Top 0.305: IC2.43 32.85,34.9 32.55,34.61 32.55,31.75 | 32.55,31.75 33.19,31.75 34.78,30.16 34.78,17.78 35.73,16.83 52.56,16.83 54.46,14.92 57,14.92 57.64,14.29 v57.64,9.52 | v27.47,30.8 27.47,31.12 28.11,31.75 32.55,31.75 | v25.57,44.13 25.57,53.02 26.52,53.98 26.52,61.91 27.16,62.55 39.86,62.55 40.49,61.91 IC1.32
  Bottom 0.305: v57.64,9.52 58.59,8.57 J2.1 | v25.57,44.13 25.57,40.32 27.47,38.42 v27.47,30.8
TCK
  Top 0.305: IC2.11 43.86,29.34 46.84,26.35 55.1,26.35 JTAG.3
TDI
  Top 0.305: IC2.9 42.26,29.03 46.21,25.08 53.19,25.08 53.83,24.45 53.83,20.64 54.46,20 JTAG.5
TDO
  Top 0.305: JTAG.4 57.64,22.54 58.27,23.18 58.27,30.8 54.78,34.29 54.78,42.23 52.56,44.45 49.06,44.45 47.8,43.18 45.26,43.18 44.62,42.55 43.35,42.55 43.06,42.84 IC2.24
TMS
  Top 0.305: IC2.10 43.06,29.18 46.52,25.72 53.83,25.72 54.46,25.08 54.46,21.91 55.1,21.27 57.64,21.27 58.27,20.64 58.27,18.1 57.64,17.46 JTAG.6

### Text on the board
tNames: ataripcb@gmail.com | Atari 7800 Maxi Cart | v1.1 | 3V3 | GND | TCK | TDO | TDI | TMS | FRONT
bNames: 3V3 | GND